# EAGLE schematic BEP32_6panel_Seed_wdrills (EAGLE 6.5.0), part 2 of 2
## Sheet 5 of 6
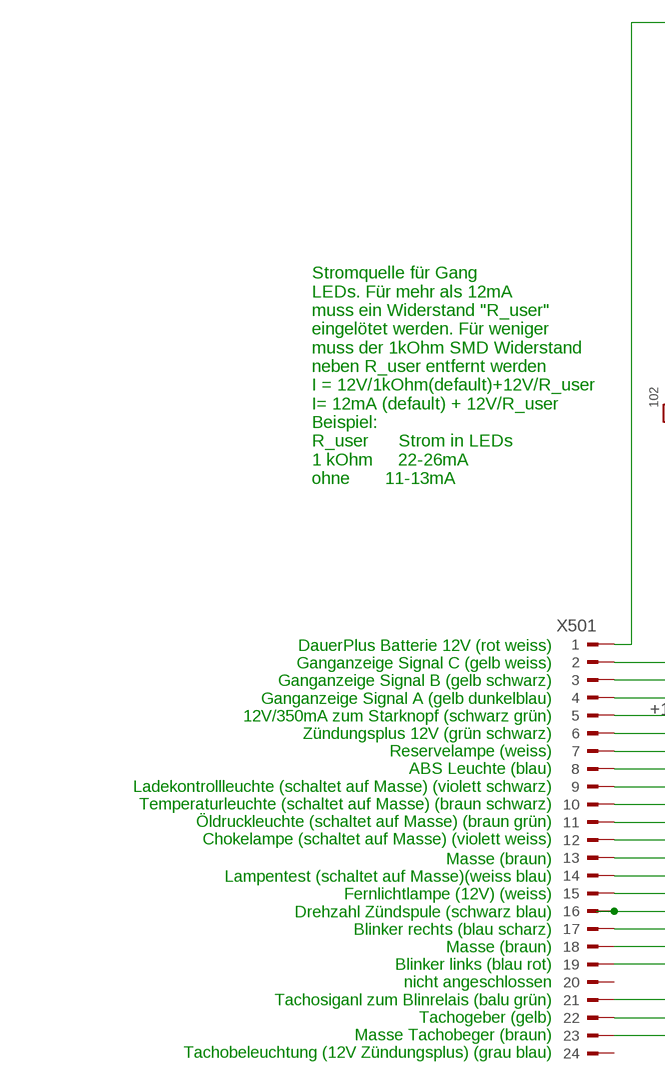
[diagram p8: schematic, sheet 5, part 1 of 2]
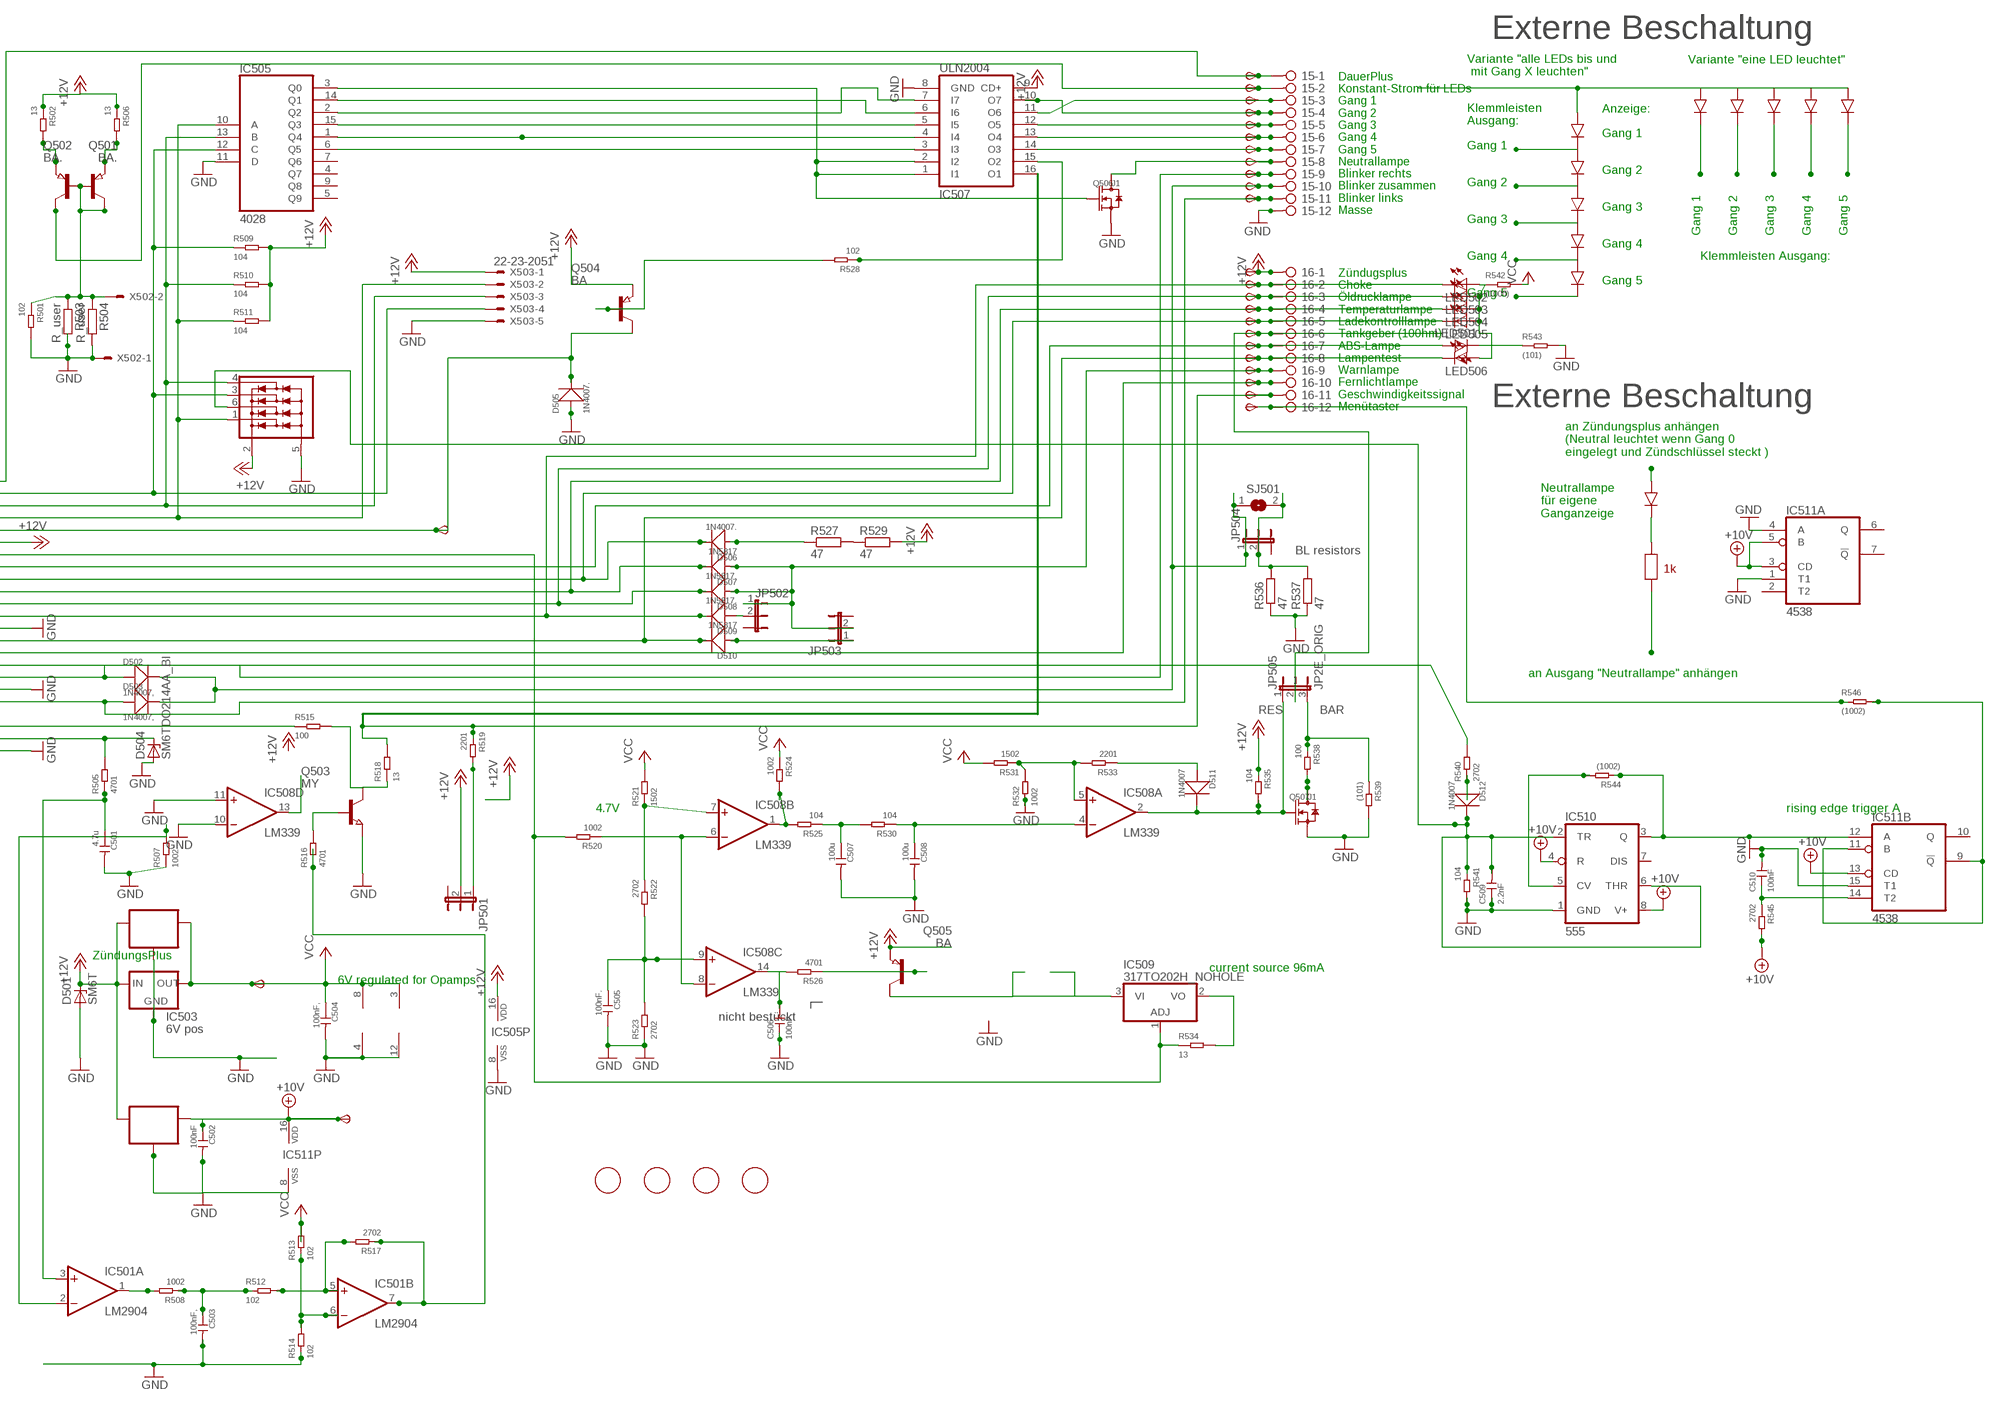
[diagram p9: schematic, sheet 5, part 2 of 2]

### Parts
6V501  TPSB2.0  [B2.0]
10V501  TPSB2.0  [B2.0]
15  2081-1132  [12-PIN]
16  2081-1132  [12-PIN]
C501  4.7u  CERAMIC-4.7UF-25V-10%-X5R(0805)  [C0805]
C502  100nF  CERAMIC-100NF-50V-10%-X7R(0805)  [C0805]
C503  100nF,  CERAMIC-100NF-50V-10%-X7R(0805)  [C0805]
C504  100nF,  CERAMIC-100NF-50V-10%-X7R(0805)  [C0805]
C505  100nF.  CERAMIC-100NF-50V-10%-X7R(0805)  [C0805]
C506  100nF.  CERAMIC-100NF-50V-10%-X7R(0805)  [C0805]
C507  100u  CERAMIC-100UF-6.3V-20%-X5R(1206)  [C1206]
C508  100u  CERAMIC-100UF-6.3V-20%-X5R(1206)  [C1206]
C509  2.2nF  CERAMIC-100NF-50V-10%-X7R(0805)  [C0805]
C510  100nF  CERAMIC-100NF-50V-10%-X7R(0805)  [C0805]
D501  SM6T  [DO214AA]
D502  1N4007,  DIODE-GEN-PURPOSE-1KV-1A(DO-214AC)  [DO-214AC]
D503  1N4007,  DIODE-GEN-PURPOSE-1KV-1A(DO-214AC)  [DO-214AC]
D504  SM6TDO214AA_BI  [DO214AA_BI]
D505  1N4007.  DIODE-GEN-PURPOSE-1KV-1A(DO-214AC)  [DO-214AC]
D506  1N4007.  DIODE-GEN-PURPOSE-1KV-1A(DO-214AC)  [DO-214AC]
D507  1N5817  DIODE-GEN-PURPOSE-1KV-1A(DO-214AC)DO-214AC/1206  [DO-214AC_SLIM]
D508  1N5817.  DIODE-GEN-PURPOSE-1KV-1A(DO-214AC)DO-214AC/1206  [DO-214AC_SLIM]
D509  1N5817.  DIODE-GEN-PURPOSE-1KV-1A(DO-214AC)DO-214AC/1206  [DO-214AC_SLIM]
D510  1N5817  DIODE-GEN-PURPOSE-1KV-1A(DO-214AC)DO-214AC/1206  [DO-214AC_SLIM]
D511  1N4007  DIODE-GEN-PURPOSE-1KV-1A(DO-214AC)  [DO-214AC]
D512  1N4007  DIODE-GEN-PURPOSE-1KV-1A(DO-214AC)  [DO-214AC]
FID501  FIDUCIAL  [FIDUCIAL_1MM]
FID502  FIDUCIAL  [FIDUCIAL_1MM]
FID503  FIDUCIAL  [FIDUCIAL_1MM]
FID504  FIDUCIAL  [FIDUCIAL_1MM]
IC501  LM2904  LM358D  [SO08]
IC502  78L06  78LXXSOT89_ROUND  [SOT89_ROUND]
IC503  6V pos  78LXX  [78LXX]
IC504  78L10  78LXXSOT89_ROUND  [SOT89_ROUND]
IC505  4028  4028D  [SO16]
IC506  NUP4304SOT457_R  [SOT457R_PHILIPS]
IC507  ULN2004  ULN2004AD  [SO16]
IC508  LM339  LM339D  [SO14]
IC509  317TO202H_NOHOLE  [TO220H_NOHOLE]
IC510  555  NE555D  [SO08]
IC511  4538  4538D  [SO16]
JP501  JP2EJP2_SMALLPADS  [JP2_SMALLPADS]
JP502  JP2EJP2_SMALLPADS  [JP2_SMALLPADS]
JP503  JP2EJP2_SMALLPADS  [JP2_SMALLPADS]
JP504  JP2EJP2_SMALLPADS  [JP2_SMALLPADS]
JP505  JP2E_ORIG  [JP2_ORIG_SMALLPADS]
LED501  LEDLD260  [LD260]
LED502  LEDLD260  [LD260]
LED503  LEDLD260  [LD260]
LED504  LEDLD260  [LD260]
LED505  LEDLD260  [LD260]
LED506  LEDLD260  [LD260]
Q501  BA.  PNP-TRANSISTOR_SOT89  [SOT89]
Q502  BA.  PNP-TRANSISTOR_SOT89  [SOT89]
Q503  MY  NPN-TRANSISTOR_SOT89  [SOT89]
Q504  BA  PNP-TRANSISTOR_SOT89  [SOT89]
Q505  BA  PNP-TRANSISTOR_SOT89  [SOT89]
Q506  J1  SMD-MOSFET-N-CH-50V-200MA-BSS138W-7-F(SOT-23)  [SOT-23]
Q507  J1  SMD-MOSFET-N-CH-50V-200MA-BSS138W-7-F(SOT-23)  [SOT-23]
R501  102  SMD-RES-1K-5%-1/8W(0805)  [R0805]
R502  13  SMD-RES-13R-5%-1/4W(1206)  [R1206]
R503  R_user  R-EU_R0805  [R0805]
R504  R_user  R-EU_R0805  [R0805]
R505  4701  SMD-RES-4.7K-5%-1/8W(0805)  [R0805]
R506  13  SMD-RES-13R-5%-1/4W(1206)  [R1206]
R507  1002  SMD-RES-10K-1%-1/8W(0805)  [R0805]
R508  1002  SMD-RES-10K-1%-1/8W(0805)  [R0805]
R509  104  SMD-RES-10K-1%-1/8W(0805)  [R0805]
R510  104  SMD-RES-10K-1%-1/8W(0805)  [R0805]
R511  104  SMD-RES-10K-1%-1/8W(0805)  [R0805]
R512  102  SMD-RES-1K-5%-1/8W(0805)  [R0805]
R513  102  SMD-RES-1K-5%-1/8W(0805)  [R0805]
R514  102  SMD-RES-1K-5%-1/8W(0805)  [R0805]
R515  100  SMD-RES-220R-5%-1/8W(0805)  [R0805]
R516  4701  SMD-RES-4.7K-5%-1/8W(0805)  [R0805]
R517  2702  SMD-RES-4.7K-5%-1/8W(0805)  [R0805]
R518  13  SMD-RES-13R-5%-1/4W(1206)  [R1206]
R519  2201  SMD-RES-2.2K-5%-1/8W(0805)  [R0805]
R520  1002  SMD-RES-10K-1%-1/8W(0805)  [R0805]
R521  1502  SMD-RES-10K-1%-1/8W(0805)  [R0805]
R522  2702  SMD-RES-4.7K-5%-1/8W(0805)  [R0805]
R523  2702  SMD-RES-4.7K-5%-1/8W(0805)  [R0805]
R524  1002  SMD-RES-10K-1%-1/8W(0805)  [R0805]
R525  104  SMD-RES-10K-1%-1/8W(0805)  [R0805]
R526  4701  SMD-RES-4.7K-5%-1/8W(0805)  [R0805]
R527  47  R-EU_V235/17_1MM  [V235/17_1MM]
R528  102  SMD-RES-1K-5%-1/8W(0805)  [R0805]
R529  47  R-EU_V235/17_1MM  [V235/17_1MM]
R530  104  SMD-RES-10K-1%-1/8W(0805)  [R0805]
R531  1502  SMD-RES-10K-1%-1/8W(0805)  [R0805]
R532  1002  SMD-RES-10K-1%-1/8W(0805)  [R0805]
R533  2201  SMD-RES-2.2K-5%-1/8W(0805)  [R0805]
R534  13  SMD-RES-13R-5%-1/4W(1206)  [R1206]
R535  104  SMD-RES-10K-1%-1/8W(0805)  [R0805]
R536  47  R-EU_V235/17_1MM  [V235/17_1MM]
R537  47  R-EU_V235/17_1MM  [V235/17_1MM]
R538  100  SMD-RES-2.2K-5%-1/8W(0805)  [R0805]
R539  (101)  SMD-RES-2.2K-5%-1/8W(0805)  [R0805]
R540  2702  SMD-RES-10K-1%-1/8W(0805)  [R0805]
R541  104  SMD-RES-10K-1%-1/8W(0805)  [R0805]
R542  (1000)  SMD-RES-100R-5%-1/8W(0805)  [R0805]
R543  (101)  SMD-RES-100R-5%-1/8W(0805)  [R0805]
R544  (1002)  SMD-RES-10K-1%-1/8W(0805)  [R0805]
R545  2702  SMD-RES-4.7K-5%-1/8W(0805)  [R0805]
R546  (1002)  SMD-RES-4.7K-5%-1/8W(0805)  [R0805]
SJ501  SJ  [SJ]
START501  TPSB2.0  [B2.0]
TP162  TPSB2.0  [B2.0]
TP163  TPSB2.0  [B2.0]
TP164  TPSB2.0  [B2.0]
TP165  TPSB2.0  [B2.0]
TP166  TPSB2.0  [B2.0]
TP167  TPSB2.0  [B2.0]
TP168  TPSB2.0  [B2.0]
TP169  TPSB2.0  [B2.0]
TP170  TPSB2.0  [B2.0]
TP171  TPSB2.0  [B2.0]
TP172  TPSB2.0  [B2.0]
TP173  TPSB2.0  [B2.0]
TP174  TPSB2.0  [B2.0]
TP175  TPSB2.0  [B2.0]
TP176  TPSB2.0  [B2.0]
TP177  TPSB2.0  [B2.0]
TP178  TPSB2.0  [B2.0]
TP179  TPSB2.0  [B2.0]
TP180  TPSB1,27  [B1,27]
TP181  TPSB2.0  [B2.0]
TP182  TPSB2.0  [B2.0]
TP183  TPSB2.0  [B2.0]
TP184  TPSB2.0  [B2.0]
X501  CON_BMWV2  [24-PIN_V2]
X502  22-23-2021  [22-23-2021]
X503  22-23-2051  [22-23-2051]

### Nets
+10V: 10V501.TP(PP) C502.1 IC504.1(OUT) IC510.4(R) IC510.8(V+) IC511.3(A:CD) IC511.5(A:B) IC511.13(B:CD) IC511.16(P:VDD) R545.2 ; also sheet 1,2,3,4,6
+12V: 16.1 D501.C IC502.3(IN) IC503.IN IC504.3(IN) IC505.16(VDD) IC506.2(V+) IC507.9(CD+) JP501.2 Q504.3(E) Q505.3(E) R502.1 R506.1 R509.2 R510.2 R511.2 R529.2 R535.1 TP183.TP(PP) X501.6 X503.1 ; also sheet 1,2,3,4,6
+12V8: IC501.7(B:OUT) R516.1 R517.1
GND: 15.12 C501.2 C502.2 C503.2 C504.2 C505.2 C506.1 C507.2 C508.2 C509.1 C510.2 D501.A D504.A D505.1(+) IC501.4(P:V-) IC502.2(GND) IC502.2@1(GND) IC503.GND IC504.2(GND) IC504.2@1(GND) IC505.8(VSS) IC505.11(D) IC506.5(V-) IC507.8(GND) IC508.10(D:-IN) IC508.11(D:+IN) IC508.12(P:GND) IC510.1(GND) IC511.1(A:T1) IC511.4(A:A) IC511.8(P:VSS) IC511.15(B:T1) Q503.3(E) Q506.2(S) Q507.2(S) R501.2 R503.2 R504.2 R507.1 R514.1 R523.1 R532.1 R536.1 R537.1 R539.2 R541.2 R543.2 X501.13 X501.18 X501.23 X502.1 X503.5 ; also sheet 1,2,3,4,6
N$687: R527.2 R529.1
N$688: 16.9 D507.1(+) D508.1(+) JP502.1 JP503.2 TP180.TP(PP)
N$689: IC505.10(A) IC506.1(D1) R511.1 X501.4 X503.2
N$690: IC505.13(B) IC506.4(D4) R510.1 X501.3 X503.3
N$691: D505.2(-) Q504.2(C) START501.TP(PP) X501.5
N$692: IC505.12(C) IC506.3(D3) R509.1 X501.2 X503.4
N$693: 16.7 LED501.A TP178.TP(PP) X501.8
N$694: 16.2 D509.2(-) LED502.K(C) TP173.TP(PP) X501.12
N$695: 16.3 D508.2(-) LED503.K(C) TP174.TP(PP) X501.11
N$696: 16.4 D507.2(-) LED504.K(C) TP175.TP(PP) X501.10
N$697: 16.8 D510.2(-) LED506.K(C) TP179.TP(PP) X501.14
N$698: 15.9 D502.1(+) TP170.TP(PP) X501.17
N$699: 15.11 D503.1(+) TP172.TP(PP) X501.19
N$700: D504.C R505.2 X501.22
N$701: C501.1 IC501.3(A:+IN) R505.1
N$702: 16.11 IC507.16(O1) R518.2 R519.1 TP182.TP(PP)
N$703: IC508.1(B:OUT) R524.2 R525.2
N$704: C507.1 R525.1 R530.2
N$705: C508.1 IC508.4(A:-IN) R530.1
N$706: IC508.5(A:+IN) R531.1 R532.2 R533.2
N$707: D511.1(+) R533.1
N$708: C505.1 IC508.9(C:+IN) R522.2 R523.2
N$709: C506.2 IC508.14(C:OUT) R526.2
N$710: Q505.1(B) R526.1
N$711: IC505.2(Q2) IC507.7(I7)
N$712: 15.5 IC507.12(O5) TP166.TP(PP)
N$713: IC505.1(Q4) IC507.4(I4)
N$714: 15.8 Q506.3(D) TP169.TP(PP)
N$715: 16.10 TP181.TP(PP) X501.15
N$716: 16.5 D506.2(-) LED505.K(C) TP176.TP(PP) X501.9
N$717: D506.1(+) R527.1
N$718: IC505.6(Q5) IC507.3(I3)
N$719: 15.4 IC507.10(O7) TP165.TP(PP)
N$720: IC509.1(ADJ) R520.2 R534.1 X501.7
N$721: IC508.6(B:-IN) IC508.8(C:-IN) R520.1
N$722: 15.2 Q501.2(C) TP163.TP(PP)
N$723: 15.1 TP162.TP(PP) X501.1
N$737: R540.2 X501.16
N$738: IC505.15(Q3) IC507.5(I5)
N$739: 15.6 IC507.13(O4) TP167.TP(PP)
N$740: 15.7 IC507.14(O3) TP168.TP(PP)
N$741: 16.6 JP505.2 TP177.TP(PP)
N$742: LED501.K(C) R543.1
N$743: LED502.A LED503.A LED504.A LED505.A LED506.A R542.1
N$744: Q504.1(B) R528.2
N$745: IC505.3(Q0) IC507.1(I1) IC507.2(I2) Q506.1(G)
N$746: IC505.14(Q1) IC507.6(I6)
N$747: 15.3 IC507.11(O6) TP164.TP(PP)
N$748: Q501.1(B) Q502.1(B) Q502.2(C) R501.1 R503.1 R504.1 X502.2
N$749: Q501.3(E) R502.2
N$750: Q502.3(E) R506.2
N$751: IC508.7(B:+IN) R521.1 R522.1
N$752: IC501.2(A:-IN) R507.2
N$753: Q503.1(B) R516.2
N$754: Q507.3(D) R538.2
N$755: IC509.2(VO) R534.2
N$756: IC509.3(VI) Q505.2(C)
N$757: C509.2 D512.2(-) IC506.6(D2) IC510.2(TR) IC510.6(THR) R541.1
N$758: IC510.5(CV) R544.2
N$759: IC510.3(Q) IC511.12(B:A) R544.1
N$760: D512.1(+) R540.1
N$761: 15.10 D502.2(-) D503.2(-) JP504.1 SJ501.1 TP171.TP(PP)
N$762: JP504.2 R536.2 R537.2 SJ501.2
N$763: IC511.9(B:!Q) IC511.11(B:B) R546.2
N$764: C510.1 IC511.14(B:T2) R545.1
N$765: JP501.1 R519.2
N$766: IC507.15(O2) R528.1
N$767: 16.12 R546.1 TP184.TP(PP)
N$768: D509.1(+) JP502.2
N$769: D511.2(-) IC508.2(A:OUT) JP505.1 Q507.1(G) R535.2
N$770: IC501.1(A:OUT) R508.2
N$771: C503.1 R508.1 R512.1
N$772: IC501.5(B:+IN) R512.2 R517.2
N$773: IC501.6(B:-IN) R513.1 R514.2
N$774: D510.1(+) JP503.1
N$775: JP505.3 R538.1 R539.1
N$776: IC508.13(D:OUT)
N$777: R515.1 X501.21
N$778: Q503.2(C) R515.2 R518.1
VCC: 6V501.TP(PP) C504.1 IC501.8(P:V+) IC502.1(OUT) IC503.OUT IC508.3(P:V+) R513.2 R521.2 R524.1 R531.2 R542.2 ; also sheet 1,2,3,4,6
Unconnected: IC505.4(Q7) IC505.5(Q9) IC505.7(Q6) IC505.9(Q8) IC510.7(DIS) IC511.2(A:T2) IC511.6(A:Q) IC511.7(A:!Q) IC511.10(B:Q) X501.20 X501.24

### Notes on the sheet
- Externe Beschaltung
- Variante "eine LED leuchtet"
- Variante "alle LEDs bis und
   mit Gang X leuchten"
- Anzeige:
- Klemmleisten
  Ausgang:
- Gang 1
- DauerPlus
  Konstant-Strom für LEDs
  Gang 1
  Gang 2
  Gang 3
  Gang 4
  Gang 5
  Neutrallampe
  Blinker rechts
  Blinker zusammen
  Blinker links
  Masse
- Gang 1
- Gang 2
- Gang 2
- Gang 3
- Gang 3
- Gang 1 | Gang 2 | Gang 3 | Gang 4 | Gang 5
- Gang 4
- Gang 4 | Klemmleisten Ausgang:
- Gang 5
- Gang 5
- Zündugsplus
  Choke
  Öldrucklampe
  Temperaturlampe
  Ladekontrolllampe
  Tankgeber (100hm)
  ABS-Lampe
  Lampentest
  Warnlampe
  Fernlichtlampe
  Geschwindigkeitssignal
  Menütaster
- Stromquelle für Gang
  LEDs. Für mehr als 12mA
  muss ein Widerstand "R_user"
  eingelötet werden. Für weniger
  muss der 1kOhm SMD Widerstand
  neben R_user entfernt werden
  I = 12V/1kOhm(default)+12V/R_user
  I= 12mA (default) + 12V/R_user
  Beispiel:
  R_user      Strom in LEDs
  1 kOhm     22-26mA
  ohne       11-13mA
- Externe Beschaltung
- an Zündungsplus anhängen
  (Neutral leuchtet wenn Gang 0
  eingelegt und Zündschlüssel steckt )
- Neutrallampe
  für eigene
  Ganganzeige
- DauerPlus Batterie 12V (rot weiss)
  Ganganzeige Signal C (gelb weiss)
  Ganganzeige Signal B (gelb schwarz)
  Ganganzeige Signal A (gelb dunkelblau)
  12V/350mA zum Starknopf (schwarz grün)
  Zündungsplus 12V (grün schwarz)
  Reservelampe (weiss)
  ABS Leuchte (blau)
  Ladekontrollleuchte (schaltet auf Masse) (violett schwarz)
  Temperaturleuchte (schaltet auf Masse) (braun schwarz)
  Öldruckleuchte (schaltet auf Masse) (braun grün)
  Chokelampe (schaltet auf Masse) (violett weiss)
- BL resistors
- 1k
- an Ausgang "Neutrallampe" anhängen
- Masse (braun)
  Lampentest (schaltet auf Masse)(weiss blau)
  Fernlichtlampe (12V) (weiss)
  Drehzahl Zündspule (schwarz blau)
  Blinker rechts (blau scharz)
  Masse (braun)
  Blinker links (blau rot)
  nicht angeschlossen
  Tachosiganl zum Blinrelais (balu grün)
  Tachogeber (gelb)
  Masse Tachobeger (braun)
  Tachobeleuchtung (12V Zündungsplus) (grau blau)
- RES | BAR
- 4.7V | rising edge trigger A
- ZündungsPlus
- current source 96mA
- 6V regulated for Opamps
- nicht bestückt

## Sheet 6 of 6
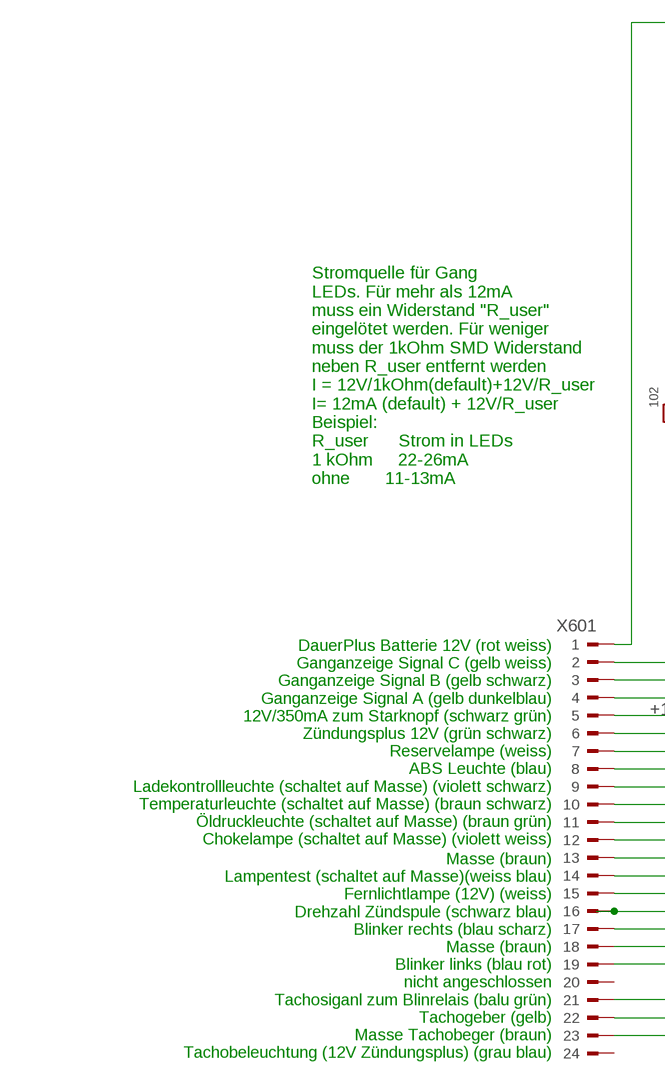
[diagram p10: schematic, sheet 6, part 1 of 2]
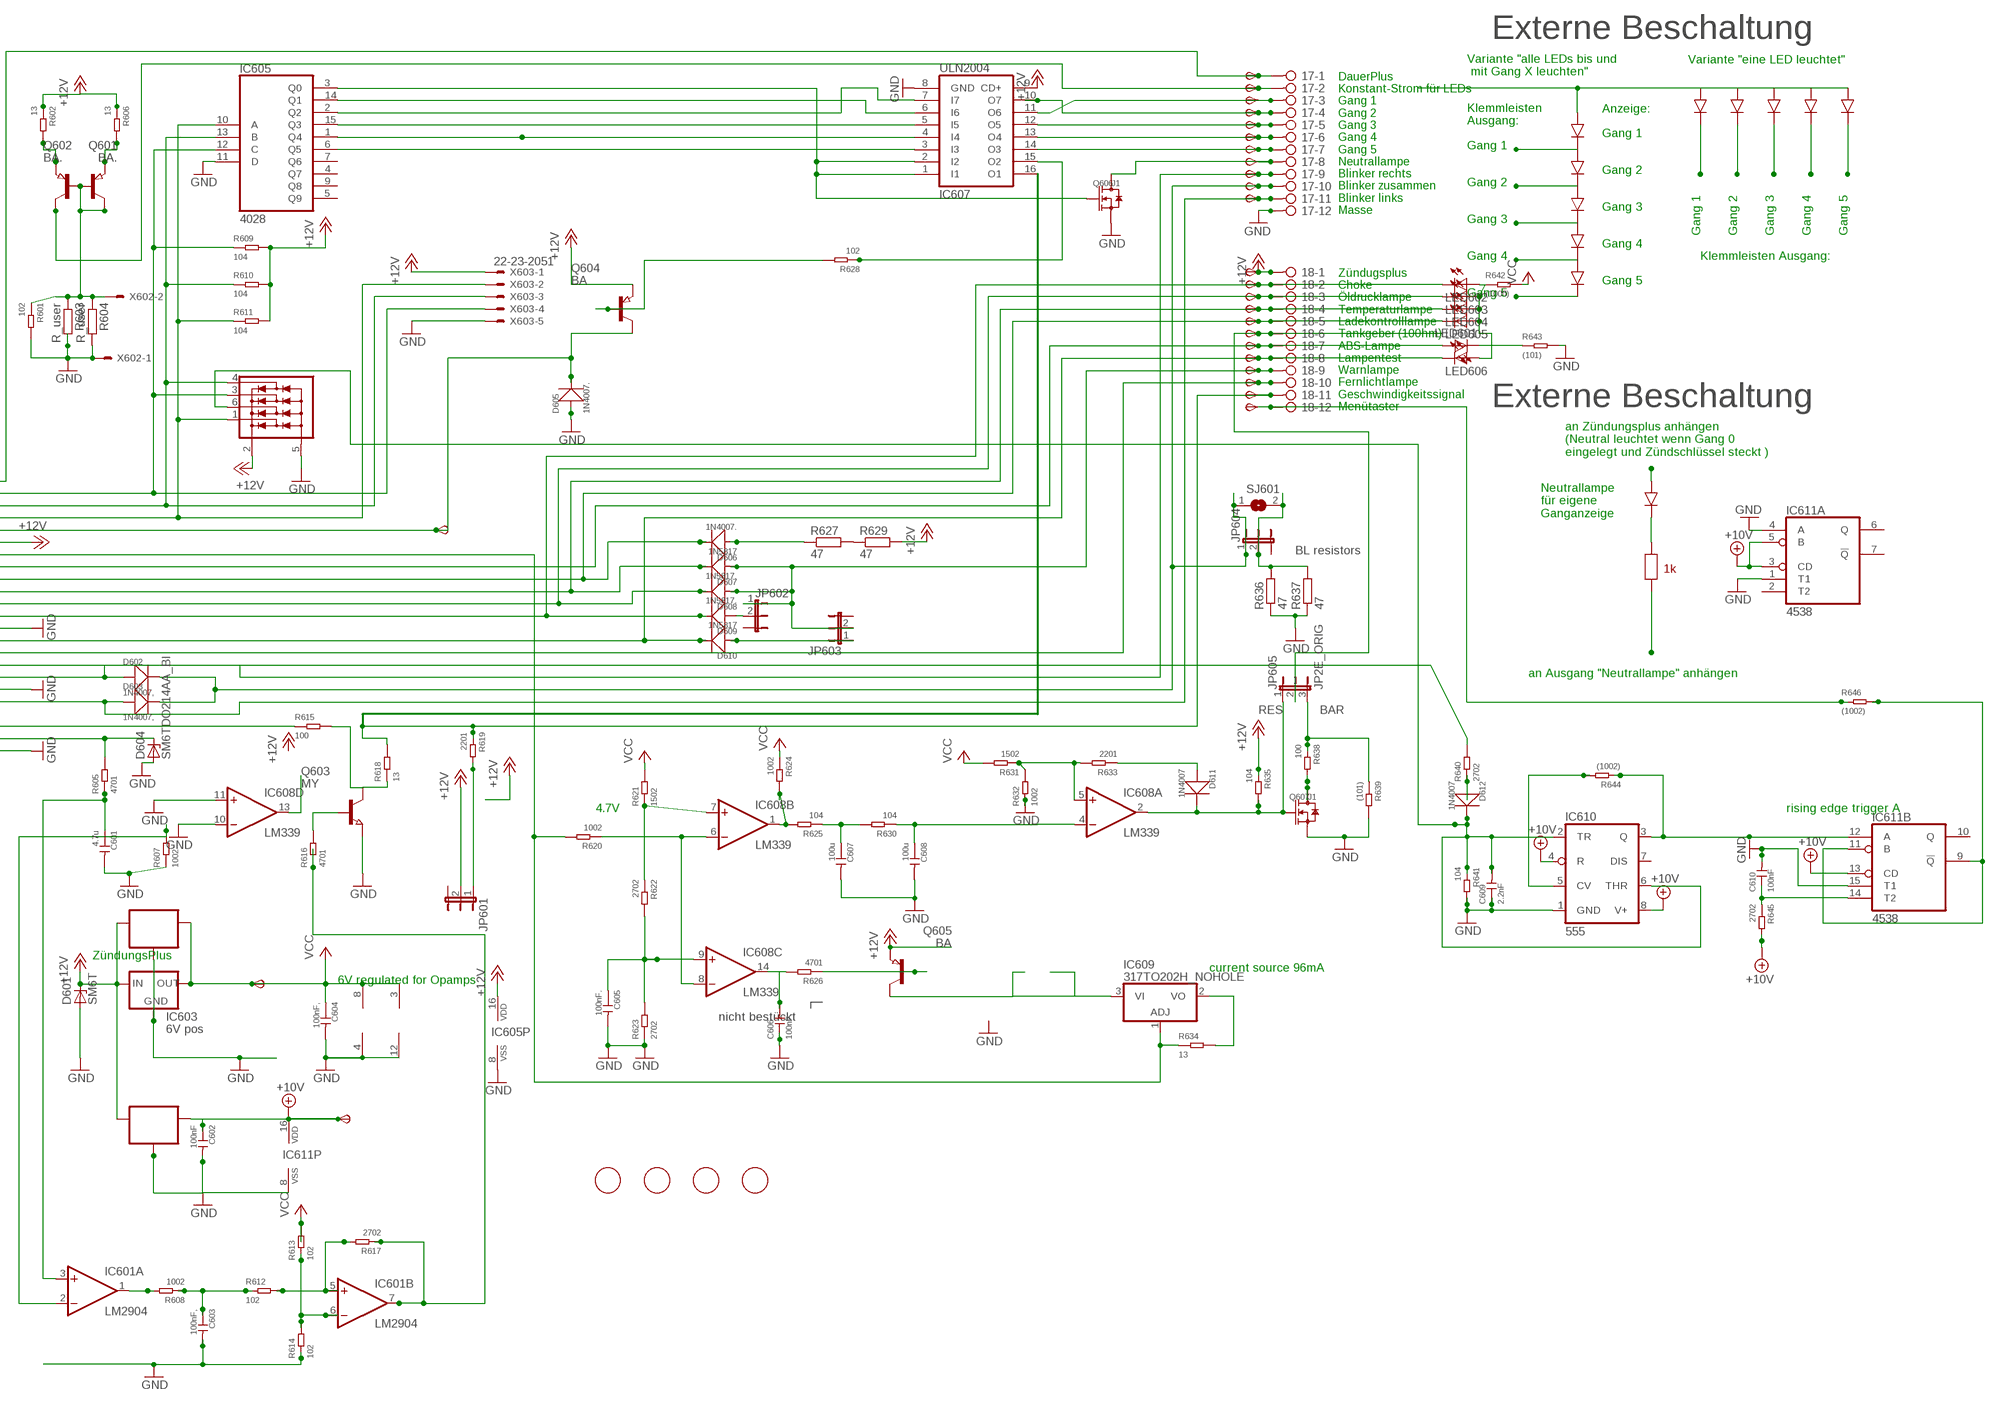
[diagram p11: schematic, sheet 6, part 2 of 2]

### Parts
6V601  TPSB2.0  [B2.0]
10V601  TPSB2.0  [B2.0]
17  2081-1132  [12-PIN]
18  2081-1132  [12-PIN]
C601  4.7u  CERAMIC-4.7UF-25V-10%-X5R(0805)  [C0805]
C602  100nF  CERAMIC-100NF-50V-10%-X7R(0805)  [C0805]
C603  100nF,  CERAMIC-100NF-50V-10%-X7R(0805)  [C0805]
C604  100nF,  CERAMIC-100NF-50V-10%-X7R(0805)  [C0805]
C605  100nF.  CERAMIC-100NF-50V-10%-X7R(0805)  [C0805]
C606  100nF.  CERAMIC-100NF-50V-10%-X7R(0805)  [C0805]
C607  100u  CERAMIC-100UF-6.3V-20%-X5R(1206)  [C1206]
C608  100u  CERAMIC-100UF-6.3V-20%-X5R(1206)  [C1206]
C609  2.2nF  CERAMIC-100NF-50V-10%-X7R(0805)  [C0805]
C610  100nF  CERAMIC-100NF-50V-10%-X7R(0805)  [C0805]
D601  SM6T  [DO214AA]
D602  1N4007,  DIODE-GEN-PURPOSE-1KV-1A(DO-214AC)  [DO-214AC]
D603  1N4007,  DIODE-GEN-PURPOSE-1KV-1A(DO-214AC)  [DO-214AC]
D604  SM6TDO214AA_BI  [DO214AA_BI]
D605  1N4007.  DIODE-GEN-PURPOSE-1KV-1A(DO-214AC)  [DO-214AC]
D606  1N4007.  DIODE-GEN-PURPOSE-1KV-1A(DO-214AC)  [DO-214AC]
D607  1N5817  DIODE-GEN-PURPOSE-1KV-1A(DO-214AC)DO-214AC/1206  [DO-214AC_SLIM]
D608  1N5817.  DIODE-GEN-PURPOSE-1KV-1A(DO-214AC)DO-214AC/1206  [DO-214AC_SLIM]
D609  1N5817.  DIODE-GEN-PURPOSE-1KV-1A(DO-214AC)DO-214AC/1206  [DO-214AC_SLIM]
D610  1N5817  DIODE-GEN-PURPOSE-1KV-1A(DO-214AC)DO-214AC/1206  [DO-214AC_SLIM]
D611  1N4007  DIODE-GEN-PURPOSE-1KV-1A(DO-214AC)  [DO-214AC]
D612  1N4007  DIODE-GEN-PURPOSE-1KV-1A(DO-214AC)  [DO-214AC]
FID601  FIDUCIAL  [FIDUCIAL_1MM]
FID602  FIDUCIAL  [FIDUCIAL_1MM]
FID603  FIDUCIAL  [FIDUCIAL_1MM]
FID604  FIDUCIAL  [FIDUCIAL_1MM]
IC601  LM2904  LM358D  [SO08]
IC602  78L06  78LXXSOT89_ROUND  [SOT89_ROUND]
IC603  6V pos  78LXX  [78LXX]
IC604  78L10  78LXXSOT89_ROUND  [SOT89_ROUND]
IC605  4028  4028D  [SO16]
IC606  NUP4304SOT457_R  [SOT457R_PHILIPS]
IC607  ULN2004  ULN2004AD  [SO16]
IC608  LM339  LM339D  [SO14]
IC609  317TO202H_NOHOLE  [TO220H_NOHOLE]
IC610  555  NE555D  [SO08]
IC611  4538  4538D  [SO16]
JP601  JP2EJP2_SMALLPADS  [JP2_SMALLPADS]
JP602  JP2EJP2_SMALLPADS  [JP2_SMALLPADS]
JP603  JP2EJP2_SMALLPADS  [JP2_SMALLPADS]
JP604  JP2EJP2_SMALLPADS  [JP2_SMALLPADS]
JP605  JP2E_ORIG  [JP2_ORIG_SMALLPADS]
LED601  LEDLD260  [LD260]
LED602  LEDLD260  [LD260]
LED603  LEDLD260  [LD260]
LED604  LEDLD260  [LD260]
LED605  LEDLD260  [LD260]
LED606  LEDLD260  [LD260]
Q601  BA.  PNP-TRANSISTOR_SOT89  [SOT89]
Q602  BA.  PNP-TRANSISTOR_SOT89  [SOT89]
Q603  MY  NPN-TRANSISTOR_SOT89  [SOT89]
Q604  BA  PNP-TRANSISTOR_SOT89  [SOT89]
Q605  BA  PNP-TRANSISTOR_SOT89  [SOT89]
Q606  J1  SMD-MOSFET-N-CH-50V-200MA-BSS138W-7-F(SOT-23)  [SOT-23]
Q607  J1  SMD-MOSFET-N-CH-50V-200MA-BSS138W-7-F(SOT-23)  [SOT-23]
R601  102  SMD-RES-1K-5%-1/8W(0805)  [R0805]
R602  13  SMD-RES-13R-5%-1/4W(1206)  [R1206]
R603  R_user  R-EU_R0805  [R0805]
R604  R_user  R-EU_R0805  [R0805]
R605  4701  SMD-RES-4.7K-5%-1/8W(0805)  [R0805]
R606  13  SMD-RES-13R-5%-1/4W(1206)  [R1206]
R607  1002  SMD-RES-10K-1%-1/8W(0805)  [R0805]
R608  1002  SMD-RES-10K-1%-1/8W(0805)  [R0805]
R609  104  SMD-RES-10K-1%-1/8W(0805)  [R0805]
R610  104  SMD-RES-10K-1%-1/8W(0805)  [R0805]
R611  104  SMD-RES-10K-1%-1/8W(0805)  [R0805]
R612  102  SMD-RES-1K-5%-1/8W(0805)  [R0805]
R613  102  SMD-RES-1K-5%-1/8W(0805)  [R0805]
R614  102  SMD-RES-1K-5%-1/8W(0805)  [R0805]
R615  100  SMD-RES-220R-5%-1/8W(0805)  [R0805]
R616  4701  SMD-RES-4.7K-5%-1/8W(0805)  [R0805]
R617  2702  SMD-RES-4.7K-5%-1/8W(0805)  [R0805]
R618  13  SMD-RES-13R-5%-1/4W(1206)  [R1206]
R619  2201  SMD-RES-2.2K-5%-1/8W(0805)  [R0805]
R620  1002  SMD-RES-10K-1%-1/8W(0805)  [R0805]
R621  1502  SMD-RES-10K-1%-1/8W(0805)  [R0805]
R622  2702  SMD-RES-4.7K-5%-1/8W(0805)  [R0805]
R623  2702  SMD-RES-4.7K-5%-1/8W(0805)  [R0805]
R624  1002  SMD-RES-10K-1%-1/8W(0805)  [R0805]
R625  104  SMD-RES-10K-1%-1/8W(0805)  [R0805]
R626  4701  SMD-RES-4.7K-5%-1/8W(0805)  [R0805]
R627  47  R-EU_V235/17_1MM  [V235/17_1MM]
R628  102  SMD-RES-1K-5%-1/8W(0805)  [R0805]
R629  47  R-EU_V235/17_1MM  [V235/17_1MM]
R630  104  SMD-RES-10K-1%-1/8W(0805)  [R0805]
R631  1502  SMD-RES-10K-1%-1/8W(0805)  [R0805]
R632  1002  SMD-RES-10K-1%-1/8W(0805)  [R0805]
R633  2201  SMD-RES-2.2K-5%-1/8W(0805)  [R0805]
R634  13  SMD-RES-13R-5%-1/4W(1206)  [R1206]
R635  104  SMD-RES-10K-1%-1/8W(0805)  [R0805]
R636  47  R-EU_V235/17_1MM  [V235/17_1MM]
R637  47  R-EU_V235/17_1MM  [V235/17_1MM]
R638  100  SMD-RES-2.2K-5%-1/8W(0805)  [R0805]
R639  (101)  SMD-RES-2.2K-5%-1/8W(0805)  [R0805]
R640  2702  SMD-RES-10K-1%-1/8W(0805)  [R0805]
R641  104  SMD-RES-10K-1%-1/8W(0805)  [R0805]
R642  (1000)  SMD-RES-100R-5%-1/8W(0805)  [R0805]
R643  (101)  SMD-RES-100R-5%-1/8W(0805)  [R0805]
R644  (1002)  SMD-RES-10K-1%-1/8W(0805)  [R0805]
R645  2702  SMD-RES-4.7K-5%-1/8W(0805)  [R0805]
R646  (1002)  SMD-RES-4.7K-5%-1/8W(0805)  [R0805]
SJ601  SJ  [SJ]
START601  TPSB2.0  [B2.0]
TP185  TPSB2.0  [B2.0]
TP186  TPSB2.0  [B2.0]
TP187  TPSB2.0  [B2.0]
TP188  TPSB2.0  [B2.0]
TP189  TPSB2.0  [B2.0]
TP190  TPSB2.0  [B2.0]
TP191  TPSB2.0  [B2.0]
TP192  TPSB2.0  [B2.0]
TP193  TPSB2.0  [B2.0]
TP194  TPSB2.0  [B2.0]
TP195  TPSB2.0  [B2.0]
TP196  TPSB2.0  [B2.0]
TP197  TPSB2.0  [B2.0]
TP198  TPSB2.0  [B2.0]
TP199  TPSB2.0  [B2.0]
TP200  TPSB2.0  [B2.0]
TP201  TPSB2.0  [B2.0]
TP202  TPSB2.0  [B2.0]
TP203  TPSB1,27  [B1,27]
TP204  TPSB2.0  [B2.0]
TP205  TPSB2.0  [B2.0]
TP206  TPSB2.0  [B2.0]
TP207  TPSB2.0  [B2.0]
X601  CON_BMWV2  [24-PIN_V2]
X602  22-23-2021  [22-23-2021]
X603  22-23-2051  [22-23-2051]

### Nets
+10V: 10V601.TP(PP) C602.1 IC604.1(OUT) IC610.4(R) IC610.8(V+) IC611.3(A:CD) IC611.5(A:B) IC611.13(B:CD) IC611.16(P:VDD) R645.2 ; also sheet 1,2,3,4,5
+12V: 18.1 D601.C IC602.3(IN) IC603.IN IC604.3(IN) IC605.16(VDD) IC606.2(V+) IC607.9(CD+) JP601.2 Q604.3(E) Q605.3(E) R602.1 R606.1 R609.2 R610.2 R611.2 R629.2 R635.1 TP206.TP(PP) X601.6 X603.1 ; also sheet 1,2,3,4,5
+12V9: IC601.7(B:OUT) R616.1 R617.1
GND: 17.12 C601.2 C602.2 C603.2 C604.2 C605.2 C606.1 C607.2 C608.2 C609.1 C610.2 D601.A D604.A D605.1(+) IC601.4(P:V-) IC602.2(GND) IC602.2@1(GND) IC603.GND IC604.2(GND) IC604.2@1(GND) IC605.8(VSS) IC605.11(D) IC606.5(V-) IC607.8(GND) IC608.10(D:-IN) IC608.11(D:+IN) IC608.12(P:GND) IC610.1(GND) IC611.1(A:T1) IC611.4(A:A) IC611.8(P:VSS) IC611.15(B:T1) Q603.3(E) Q606.2(S) Q607.2(S) R601.2 R603.2 R604.2 R607.1 R614.1 R623.1 R632.1 R636.1 R637.1 R639.2 R641.2 R643.2 X601.13 X601.18 X601.23 X602.1 X603.5 ; also sheet 1,2,3,4,5
N$779: R627.2 R629.1
N$780: 18.9 D607.1(+) D608.1(+) JP602.1 JP603.2 TP203.TP(PP)
N$781: IC605.10(A) IC606.1(D1) R611.1 X601.4 X603.2
N$782: IC605.13(B) IC606.4(D4) R610.1 X601.3 X603.3
N$783: D605.2(-) Q604.2(C) START601.TP(PP) X601.5
N$784: IC605.12(C) IC606.3(D3) R609.1 X601.2 X603.4
N$785: 18.7 LED601.A TP201.TP(PP) X601.8
N$786: 18.2 D609.2(-) LED602.K(C) TP196.TP(PP) X601.12
N$787: 18.3 D608.2(-) LED603.K(C) TP197.TP(PP) X601.11
N$788: 18.4 D607.2(-) LED604.K(C) TP198.TP(PP) X601.10
N$789: 18.8 D610.2(-) LED606.K(C) TP202.TP(PP) X601.14
N$790: 17.9 D602.1(+) TP193.TP(PP) X601.17
N$791: 17.11 D603.1(+) TP195.TP(PP) X601.19
N$792: D604.C R605.2 X601.22
N$793: C601.1 IC601.3(A:+IN) R605.1
N$794: 18.11 IC607.16(O1) R618.2 R619.1 TP205.TP(PP)
N$795: IC608.1(B:OUT) R624.2 R625.2
N$796: C607.1 R625.1 R630.2
N$797: C608.1 IC608.4(A:-IN) R630.1
N$798: IC608.5(A:+IN) R631.1 R632.2 R633.2
N$799: D611.1(+) R633.1
N$800: C605.1 IC608.9(C:+IN) R622.2 R623.2
N$801: C606.2 IC608.14(C:OUT) R626.2
N$802: Q605.1(B) R626.1
N$803: IC605.2(Q2) IC607.7(I7)
N$804: 17.5 IC607.12(O5) TP189.TP(PP)
N$805: IC605.1(Q4) IC607.4(I4)
N$806: 17.8 Q606.3(D) TP192.TP(PP)
N$807: 18.10 TP204.TP(PP) X601.15
N$808: 18.5 D606.2(-) LED605.K(C) TP199.TP(PP) X601.9
N$809: D606.1(+) R627.1
N$810: IC605.6(Q5) IC607.3(I3)
N$811: 17.4 IC607.10(O7) TP188.TP(PP)
N$812: IC609.1(ADJ) R620.2 R634.1 X601.7
N$813: IC608.6(B:-IN) IC608.8(C:-IN) R620.1
N$814: 17.2 Q601.2(C) TP186.TP(PP)
N$815: 17.1 TP185.TP(PP) X601.1
N$829: R640.2 X601.16
N$830: IC605.15(Q3) IC607.5(I5)
N$831: 17.6 IC607.13(O4) TP190.TP(PP)
N$832: 17.7 IC607.14(O3) TP191.TP(PP)
N$833: 18.6 JP605.2 TP200.TP(PP)
N$834: LED601.K(C) R643.1
N$835: LED602.A LED603.A LED604.A LED605.A LED606.A R642.1
N$836: Q604.1(B) R628.2
N$837: IC605.3(Q0) IC607.1(I1) IC607.2(I2) Q606.1(G)
N$838: IC605.14(Q1) IC607.6(I6)
N$839: 17.3 IC607.11(O6) TP187.TP(PP)
N$840: Q601.1(B) Q602.1(B) Q602.2(C) R601.1 R603.1 R604.1 X602.2
N$841: Q601.3(E) R602.2
N$842: Q602.3(E) R606.2
N$843: IC608.7(B:+IN) R621.1 R622.1
N$844: IC601.2(A:-IN) R607.2
N$845: Q603.1(B) R616.2
N$846: Q607.3(D) R638.2
N$847: IC609.2(VO) R634.2
N$848: IC609.3(VI) Q605.2(C)
N$849: C609.2 D612.2(-) IC606.6(D2) IC610.2(TR) IC610.6(THR) R641.1
N$850: IC610.5(CV) R644.2
N$851: IC610.3(Q) IC611.12(B:A) R644.1
N$852: D612.1(+) R640.1
N$853: 17.10 D602.2(-) D603.2(-) JP604.1 SJ601.1 TP194.TP(PP)
N$854: JP604.2 R636.2 R637.2 SJ601.2
N$855: IC611.9(B:!Q) IC611.11(B:B) R646.2
N$856: C610.1 IC611.14(B:T2) R645.1
N$857: JP601.1 R619.2
N$858: IC607.15(O2) R628.1
N$859: 18.12 R646.1 TP207.TP(PP)
N$860: D609.1(+) JP602.2
N$861: D611.2(-) IC608.2(A:OUT) JP605.1 Q607.1(G) R635.2
N$862: IC601.1(A:OUT) R608.2
N$863: C603.1 R608.1 R612.1
N$864: IC601.5(B:+IN) R612.2 R617.2
N$865: IC601.6(B:-IN) R613.1 R614.2
N$866: D610.1(+) JP603.1
N$867: JP605.3 R638.1 R639.1
N$868: IC608.13(D:OUT)
N$869: R615.1 X601.21
N$870: Q603.2(C) R615.2 R618.1
VCC: 6V601.TP(PP) C604.1 IC601.8(P:V+) IC602.1(OUT) IC603.OUT IC608.3(P:V+) R613.2 R621.2 R624.1 R631.2 R642.2 ; also sheet 1,2,3,4,5
Unconnected: IC605.4(Q7) IC605.5(Q9) IC605.7(Q6) IC605.9(Q8) IC610.7(DIS) IC611.2(A:T2) IC611.6(A:Q) IC611.7(A:!Q) IC611.10(B:Q) X601.20 X601.24

### Notes on the sheet
- Externe Beschaltung
- Variante "eine LED leuchtet"
- Variante "alle LEDs bis und
   mit Gang X leuchten"
- Anzeige:
- Klemmleisten
  Ausgang:
- Gang 1
- DauerPlus
  Konstant-Strom für LEDs
  Gang 1
  Gang 2
  Gang 3
  Gang 4
  Gang 5
  Neutrallampe
  Blinker rechts
  Blinker zusammen
  Blinker links
  Masse
- Gang 1
- Gang 2
- Gang 2
- Gang 3
- Gang 3
- Gang 1 | Gang 2 | Gang 3 | Gang 4 | Gang 5
- Gang 4
- Gang 4 | Klemmleisten Ausgang:
- Gang 5
- Gang 5
- Zündugsplus
  Choke
  Öldrucklampe
  Temperaturlampe
  Ladekontrolllampe
  Tankgeber (100hm)
  ABS-Lampe
  Lampentest
  Warnlampe
  Fernlichtlampe
  Geschwindigkeitssignal
  Menütaster
- Stromquelle für Gang
  LEDs. Für mehr als 12mA
  muss ein Widerstand "R_user"
  eingelötet werden. Für weniger
  muss der 1kOhm SMD Widerstand
  neben R_user entfernt werden
  I = 12V/1kOhm(default)+12V/R_user
  I= 12mA (default) + 12V/R_user
  Beispiel:
  R_user      Strom in LEDs
  1 kOhm     22-26mA
  ohne       11-13mA
- Externe Beschaltung
- an Zündungsplus anhängen
  (Neutral leuchtet wenn Gang 0
  eingelegt und Zündschlüssel steckt )
- Neutrallampe
  für eigene
  Ganganzeige
- DauerPlus Batterie 12V (rot weiss)
  Ganganzeige Signal C (gelb weiss)
  Ganganzeige Signal B (gelb schwarz)
  Ganganzeige Signal A (gelb dunkelblau)
  12V/350mA zum Starknopf (schwarz grün)
  Zündungsplus 12V (grün schwarz)
  Reservelampe (weiss)
  ABS Leuchte (blau)
  Ladekontrollleuchte (schaltet auf Masse) (violett schwarz)
  Temperaturleuchte (schaltet auf Masse) (braun schwarz)
  Öldruckleuchte (schaltet auf Masse) (braun grün)
  Chokelampe (schaltet auf Masse) (violett weiss)
- BL resistors
- 1k
- an Ausgang "Neutrallampe" anhängen
- Masse (braun)
  Lampentest (schaltet auf Masse)(weiss blau)
  Fernlichtlampe (12V) (weiss)
  Drehzahl Zündspule (schwarz blau)
  Blinker rechts (blau scharz)
  Masse (braun)
  Blinker links (blau rot)
  nicht angeschlossen
  Tachosiganl zum Blinrelais (balu grün)
  Tachogeber (gelb)
  Masse Tachobeger (braun)
  Tachobeleuchtung (12V Zündungsplus) (grau blau)
- RES | BAR
- 4.7V | rising edge trigger A
- ZündungsPlus
- current source 96mA
- 6V regulated for Opamps
- nicht bestückt

## Library data of the parts
1-6 13-18 = con WAGO BMW:2081-1132: WAGO SREW CLAMP
6V 6V201 6V301 6V401 6V501 6V601 10V 10V201 10V301 10V401 10V501 10V601 START START201 START301 START401 START501 START601 TP1-TP69 TP139-TP207 = testpin_BMW:TPS: TEST PIN
C101 C201 C301 C401 C501 C601 = Seeed-Capacitor-2016:CERAMIC-4.7UF-25V-10%-X5R(0805): 302010146; MPN: CC0805KKX5R8BB475; VALUE: 4.7uf
C102-C106 C109 C110 C202-C206 C209 C210 C302-C306 C309 C310 C402-C406 C409 C410 C502-C506 C509 C510 C602-C606 C609 C610 = Seeed-Capacitor-2016:CERAMIC-100NF-50V-10%-X7R(0805): 302010165; MPN: CC0805KRX7R9BB104; VALUE: 100nf
C107 C108 C207 C208 C307 C308 C407 C408 C507 C508 C607 C608 = Seeed-Capacitor-2016:CERAMIC-100UF-6.3V-20%-X5R(1206): 302010183; MPN: GRM31CR60J107ME39L; VALUE: 100uf
D101 D104 D201 D204 D301 D304 D401 D404 D501 D504 D601 D604 = Suppressor_Diode_DO214AA:SM6T: Z DIODE
D102 D103 D105 D106 D202 D203 D205 D206 D302 D303 D305 D306 D402 D403 D405 D406 D502 D503 D505 D506 D602 D603 D605 D606 = Diode-do214ac:DIODE-GEN-PURPOSE-1KV-1A(DO-214AC): 304010013; MPN: 1N4007; VALUE: 1N4007
D107-D110 D207-D210 D307-D310 D407-D410 D507-D510 D607-D610 = Diode-do214ac:DIODE-GEN-PURPOSE-1KV-1A(DO-214AC): 304010013
D111 D112 D211 D212 D311 D312 D411 D412 D511 D512 D611 D612 = Diode-do214ac:DIODE-GEN-PURPOSE-1KV-1A(DO-214AC): 304010013; MPN: 1N4007
FID1 FID1B FID2 FID2B FID101-FID104 FID201-FID204 FID301-FID304 FID401-FID404 FID501-FID504 FID601-FID604 = Fiducial:FIDUCIAL: For use by pick and place machines to calibrate the vision/machine, 1mm By microbuilder.eu
IC101 IC201 IC301 IC401 IC501 IC601 = linear_BMW:LM358: OP AMP also LM158; LM258; LM2904 Source: http://cache.national.com/ds/LM/LM158.pdf
IC102 IC104 IC202 IC204 IC302 IC304 IC402 IC404 IC502 IC504 IC602 IC604 = 78LXX:78LXX
IC103 IC203 IC303 IC403 IC503 IC603 = v-reg:78LXX: VOLTAGE REGULATOR
IC105 IC205 IC305 IC405 IC505 IC605 = 4028:4028: BCD to decimal DECODER
IC106 IC206 IC306 IC406 IC506 IC606 = NUP4304_ESD_Diode_Array:NUP4304
IC107 IC207 IC307 IC407 IC507 IC607 = uln-udn:ULN2004A: DRIVER ARRAY
IC108 IC208 IC308 IC408 IC508 IC608 = LM339:LM339: Low Power Low Offset Voltage Quad Comparators with open collector; LM139/LM239/LM339/LM2901/LM3302
IC109 IC209 IC309 IC409 IC509 IC609 = linear_BMW:*317: Positive VOLTAGE REGULATOR
IC110 IC210 IC310 IC410 IC510 IC610 = linear:*555: TIMER
IC111 IC211 IC311 IC411 IC511 IC611 = 45xx:4538: Dual precision monostable MULTIVIBRATOR
JP101-JP104 JP201-JP204 JP301-JP304 JP401-JP404 JP501-JP504 JP601-JP604 = Switch Aliexpress 2:JP2E: JUMPER
JP105 JP205 JP305 JP405 JP505 JP605 = Switch Aliexpress 2:JP2E_ORIG
LED101-LED106 LED201-LED206 LED301-LED306 LED401-LED406 LED501-LED506 LED601-LED606 = led:LED: LED OSRAM: - CHIPLED LG R971, LG N971, LY N971, LG Q971, LY Q971, LO R971, LY R971 LH N974, LH R974 LS Q976, LO Q976, LY Q976 LO Q996 - Hyper CHIPLED LW Q18S LB Q993, LB Q99A, LB R99A - SideLED LS A670, LO A670, LY A670, LG A670, LP A670 LB A673, LV A673, LT A673, LW A673 LH A674 LY A675 LS A676, LA A676, LO A676, LY A676, LW A676 LS A679, LY A679, LG A679 - Hyper Micro SIDELED® LS Y876, LA Y876, LO Y876, LY Y876 LT Y87S - SmartLED LW L88C, LW L88S LB L89C, LB L89S, LG L890 LS L89K, LO L89K, LY L89K LS L896, LA L896, LO L896, LY L896 - TOPLED LS T670, LO T670, LY T670, LG T670, LP T670 LSG T670, LSP T670, LSY T670, LOP T670, LYG T670 LG T671, LOG T671, LSG T671 LB T673, LV T673, LT T673, LW T673 LH T674 LS T676, LA T676, LO T676, LY T676, LB T676, LH T676, LSB T676, LW T676 LB T67C, LV T67C, LT T67C, LS T67K, LO T67K, LY T67K, LW E67C LS E67B, LA E67B, LO E67B, LY E67B, LB E67C, LV E67C, LT E67C LW T67C LS T679, LY T679, LG T679 LS T770, LO T770, LY T770, LG T770, LP T770 LB T773, LV T773, LT T773, LW T773 LH T774 LS E675, LA E675, LY E675, LS T675 LS T776, LA T776, LO T776, LY T776, LB T776 LHGB T686 LT T68C, LB T68C - Hyper Mini TOPLED® LB M676 - Mini TOPLED Santana® LG M470 LS M47K, LO M47K, LY M47K Source: http://www.osram.convergy.de LUXEON: - LUMILED® LXK2-PW12-R00, LXK2-PW12-S00, LXK2-PW14-U00, LXK2-PW14-V00 LXK2-PM12-R00, LXK2-PM12-S00, LXK2-PM14-U00 LXK2-PE12-Q00, LXK2-PE12-R00, LXK2-PE12-S00, LXK2-PE14-T00, LXK2-PE14-U00 LXK2-PB12-K00, LXK2-PB12-L00, LXK2-PB12-M00, LXK2-PB14-N00, LXK2-PB14-P00, LXK2-PB14-Q00 LXK2-PR12-L00, LXK2-PR12-M00, LXK2-PR14-Q00, LXK2-PR14-R00 LXK2-PD12-Q00, LXK2-PD12-R00, LXK2-PD12-S00 LXK2-PH12-R00, LXK2-PH12-S00 LXK2-PL12-P00, LXK2-PL12-Q00, LXK2-PL12-R00 Source: www.luxeon.com KINGBRIGHT: KA-3528ASYC Source: www.kingbright.com
Q101 Q102 Q104 Q105 Q201 Q202 Q204 Q205 Q301 Q302 Q304 Q305 Q401 Q402 Q404 Q405 Q501 Q502 Q504 Q505 Q601 Q602 Q604 Q605 = Transistor_SOT89:PNP-TRANSISTOR_: PNP TRANSISTOR
Q103 Q203 Q303 Q403 Q503 Q603 = Transistor_SOT89:NPN-TRANSISTOR_: NPN TRANSISTOR
Q106 Q107 Q206 Q207 Q306 Q307 Q406 Q407 Q506 Q507 Q606 Q607 = Seeed-Transistor-2016:SMD-MOSFET-N-CH-50V-200MA-BSS138W-7-F(SOT-23): 305030000; MPN: BSS138W-7-F; VALUE: BSS138W-7-F
R101 R112-R114 R128 R201 R212-R214 R228 R301 R312-R314 R328 R401 R412-R414 R428 R501 R512-R514 R528 R601 R612-R614 R628 = Seeed-Resistor-2016:SMD-RES-1K-5%-1/8W(0805): 301010311; MPN: RC0805JR-071KL; VALUE: 1K
R102 R106 R118 R134 R202 R206 R218 R234 R302 R306 R318 R334 R402 R406 R418 R434 R502 R506 R518 R534 R602 R606 R618 R634 = Seeed-Resistor-2016:SMD-RES-13R-5%-1/4W(1206): 301010405; MPN: RC1206JR-0713RL; VALUE: 13R
R103 R104 R127 R129 R136 R137 R203 R204 R227 R229 R236 R237 R303 R304 R327 R329 R336 R337 R403 R404 R427 R429 R436 R437 R503 R504 R527 R529 R536 R537 R603 R604 R627 R629 R636 R637 = rcl:R-EU_: RESISTOR, European symbol
R105 R116 R117 R122 R123 R126 R145 R146 R205 R216 R217 R222 R223 R226 R245 R246 R305 R316 R317 R322 R323 R326 R345 R346 R405 R416 R417 R422 R423 R426 R445 R446 R505 R516 R517 R522 R523 R526 R545 R546 R605 R616 R617 R622 R623 R626 R645 R646 = Seeed-Resistor-2016:SMD-RES-4.7K-5%-1/8W(0805): 301010306; MPN: RC0805JR-074K7L; VALUE: 4.7K
R107-R111 R120 R121 R124 R125 R130-R132 R135 R140 R141 R144 R207-R211 R220 R221 R224 R225 R230-R232 R235 R240 R241 R244 R307-R311 R320 R321 R324 R325 R330-R332 R335 R340 R341 R344 R407-R411 R420 R421 R424 R425 R430-R432 R435 R440 R441 R444 R507-R511 R520 R521 R524 R525 R530-R532 R535 R540 R541 R544 R607-R611 R620 R621 R624 R625 R630-R632 R635 R640 R641 R644 = Seeed-Resistor-2016:SMD-RES-10K-1%-1/8W(0805): 301010361; MPN: RC0805FR-0710KL; VALUE: 10K
R115 R215 R315 R415 R515 R615 = Seeed-Resistor-2016:SMD-RES-220R-5%-1/8W(0805): 301010315; MPN: RC0805JR-07220RL; VALUE: 220R
R119 R133 R138 R139 R219 R233 R238 R239 R319 R333 R338 R339 R419 R433 R438 R439 R519 R533 R538 R539 R619 R633 R638 R639 = Seeed-Resistor-2016:SMD-RES-2.2K-5%-1/8W(0805): 301010333; MPN: RC0805JR-072K2L; VALUE: 2.2K
R142 R143 R242 R243 R342 R343 R442 R443 R542 R543 R642 R643 = Seeed-Resistor-2016:SMD-RES-100R-5%-1/8W(0805): 301010319; MPN: RC0805JR-07100RL; VALUE: 100R
SJ101 SJ201 SJ301 SJ401 SJ501 SJ601 = solder-jumper:SJ: SMD solder JUMPER
X101 X201 X301 X401 X501 X601 = con_BMW:CON_BMW: BMW CONNECTOR
X102 X202 X302 X402 X502 X602 = con_Molex_BMW:22-23-2021: .100" (2.54mm) Center Header - 2 Pin; MF: MOLEX; MPN: 22-23-2021; OC_FARNELL: 1462926; OC_NEWARK: 25C3832
X103 X203 X303 X403 X503 X603 = con_Molex_BMW:22-23-2051: .100" (2.54mm) Center Header - 5 Pin; MF: MOLEX; MPN: 22-23-2051; OC_FARNELL: 1462952; OC_NEWARK: 38C9178